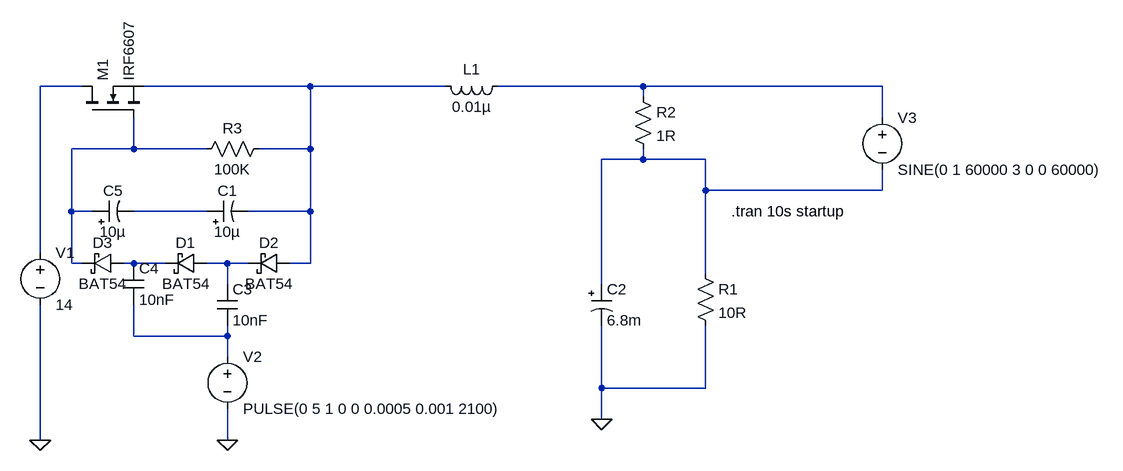
[diagram p0: schematic nchannel-softstart.asc]
nchannel-softstart.asc, the LTspice schematic file:
Version 4
SHEET 1 1620 680
WIRE 16 80 -48 80
WIRE 368 80 112 80
WIRE 576 80 368 80
WIRE 880 80 656 80
WIRE 1248 80 880 80
WIRE 880 96 880 80
WIRE 1248 128 1248 80
WIRE 96 176 96 128
WIRE 96 176 0 176
WIRE 208 176 96 176
WIRE 368 176 368 80
WIRE 368 176 288 176
WIRE 880 192 880 176
WIRE 880 192 816 192
WIRE 976 192 880 192
WIRE 976 240 976 192
WIRE 1248 240 1248 208
WIRE 1248 240 976 240
WIRE 0 272 0 176
WIRE 32 272 0 272
WIRE 208 272 96 272
WIRE 368 272 368 176
WIRE 368 272 272 272
WIRE -48 336 -48 80
WIRE 0 352 0 272
WIRE 16 352 0 352
WIRE 96 352 80 352
WIRE 144 352 96 352
WIRE 240 352 208 352
WIRE 272 352 240 352
WIRE 368 352 368 272
WIRE 368 352 336 352
WIRE 976 368 976 240
WIRE 240 384 240 352
WIRE 816 384 816 192
WIRE 96 464 96 416
WIRE 240 464 240 448
WIRE 240 464 96 464
WIRE 240 496 240 464
WIRE 816 544 816 448
WIRE 976 544 976 448
WIRE 976 544 816 544
WIRE 816 592 816 544
WIRE -48 624 -48 416
WIRE 240 624 240 576
FLAG 240 624 0
FLAG -48 624 0
FLAG 816 592 0
SYMBOL voltage -48 320 R0
SYMATTR InstName V1
SYMATTR Value 14
SYMATTR SpiceLine Rser=1
SYMBOL polcap 208 288 R270
WINDOW 0 32 32 VTop 2
WINDOW 3 0 32 VBottom 2
SYMATTR InstName C1
SYMATTR Value 10µ
SYMATTR Description Capacitor
SYMATTR Type cap
SYMATTR SpiceLine V=106M008ATE055 Rser=55m Lser=0 mfg="   ---" pn="   ---" type="   ---"
SYMBOL polcap 800 384 R0
WINDOW 0 24 8 Left 2
WINDOW 3 24 56 Left 2
SYMATTR InstName C2
SYMATTR Value 6.8m
SYMATTR SpiceLine Rser=3m Lser=0 mfg="   ---" pn="   ---" type="   ---"
SYMATTR Description Capacitor
SYMATTR Type cap
SYMBOL res 960 352 R0
SYMATTR InstName R1
SYMATTR Value 10R
SYMBOL nmos 16 128 R270
SYMATTR InstName M1
SYMATTR Value IRF6607
SYMBOL res 304 160 R90
WINDOW 0 0 56 VBottom 2
WINDOW 3 32 56 VTop 2
SYMATTR InstName R3
SYMATTR Value 100K
SYMBOL cap 224 384 R0
SYMATTR InstName C3
SYMATTR Value 10nF
SYMBOL voltage 240 480 R0
SYMATTR InstName V2
SYMATTR Value PULSE(0 5 1 0 0 0.0005 0.001 2100)
SYMBOL schottky 208 336 R90
WINDOW 0 0 32 VBottom 2
WINDOW 3 32 32 VTop 2
SYMATTR InstName D1
SYMATTR Value BAT54
SYMBOL schottky 336 336 R90
WINDOW 0 0 32 VBottom 2
WINDOW 3 32 32 VTop 2
SYMATTR InstName D2
SYMATTR Value BAT54
SYMBOL voltage 1248 112 R0
SYMATTR InstName V3
SYMATTR Value SINE(0 1 60000 3 0 0 60000)
SYMBOL res 864 80 R0
SYMATTR InstName R2
SYMATTR Value 1R
SYMBOL ind 672 64 R90
WINDOW 0 5 56 VBottom 2
WINDOW 3 32 56 VTop 2
SYMATTR InstName L1
SYMATTR Value 0.01µ
SYMATTR SpiceLine Ipk=1.5 Rser=820m Rpar=1.171K Cpar=0 mfg="   ---" pn="   ---"
SYMBOL cap 80 352 R0
SYMATTR InstName C4
SYMATTR Value 10nF
SYMBOL schottky 80 336 R90
WINDOW 0 0 32 VBottom 2
WINDOW 3 32 32 VTop 2
SYMATTR InstName D3
SYMATTR Value BAT54
SYMBOL polcap 32 288 R270
WINDOW 0 32 32 VTop 2
WINDOW 3 0 32 VBottom 2
SYMATTR InstName C5
SYMATTR Value 10µ
SYMATTR Description Capacitor
SYMATTR Type cap
SYMATTR SpiceLine V=106M008ATE055 Rser=55m Lser=0 mfg="   ---" pn="   ---" type="   ---"
TEXT 1016 272 Left 2 !.tran 10s startup

The netlist it stands for:
* nchannel-softstart.asc
V1 N001 0 14 Rser=1
C1 N006 N002 10µ V=106M008ATE055 Rser=55m Lser=0 mfg="   ---" pn="   ---" type="   ---"
C2 N005 0 6.8m Rser=3m Lser=0 mfg="   ---" pn="   ---" type="   ---"
R1 N005 0 10R
M1 N001 N004 N002 N002 IRF6607
R3 N002 N004 100K
C3 N008 N009 10nF
V2 N009 0 PULSE(0 5 1 0 0 0.0005 0.001 2100)
D1 N008 N007 BAT54
D2 N002 N008 BAT54
V3 N003 N005 SINE(0 1 60000 3 0 0 60000)
R2 N003 N005 1R
L1 N003 N002 0.01µ Ipk=1.5 Rser=820m Rpar=1.171K Cpar=0 mfg="   ---" pn="   ---"
C4 N007 N009 10nF
D3 N007 N004 BAT54
C5 N004 N006 10µ V=106M008ATE055 Rser=55m Lser=0 mfg="   ---" pn="   ---" type="   ---"
.model D D
.lib standard.dio
.model NMOS NMOS
.model PMOS PMOS
.lib standard.mos
.tran 10s startup
.backanno
.end